# EAGLE design 549-teletouch-sensor (EAGLE 8.0.0)
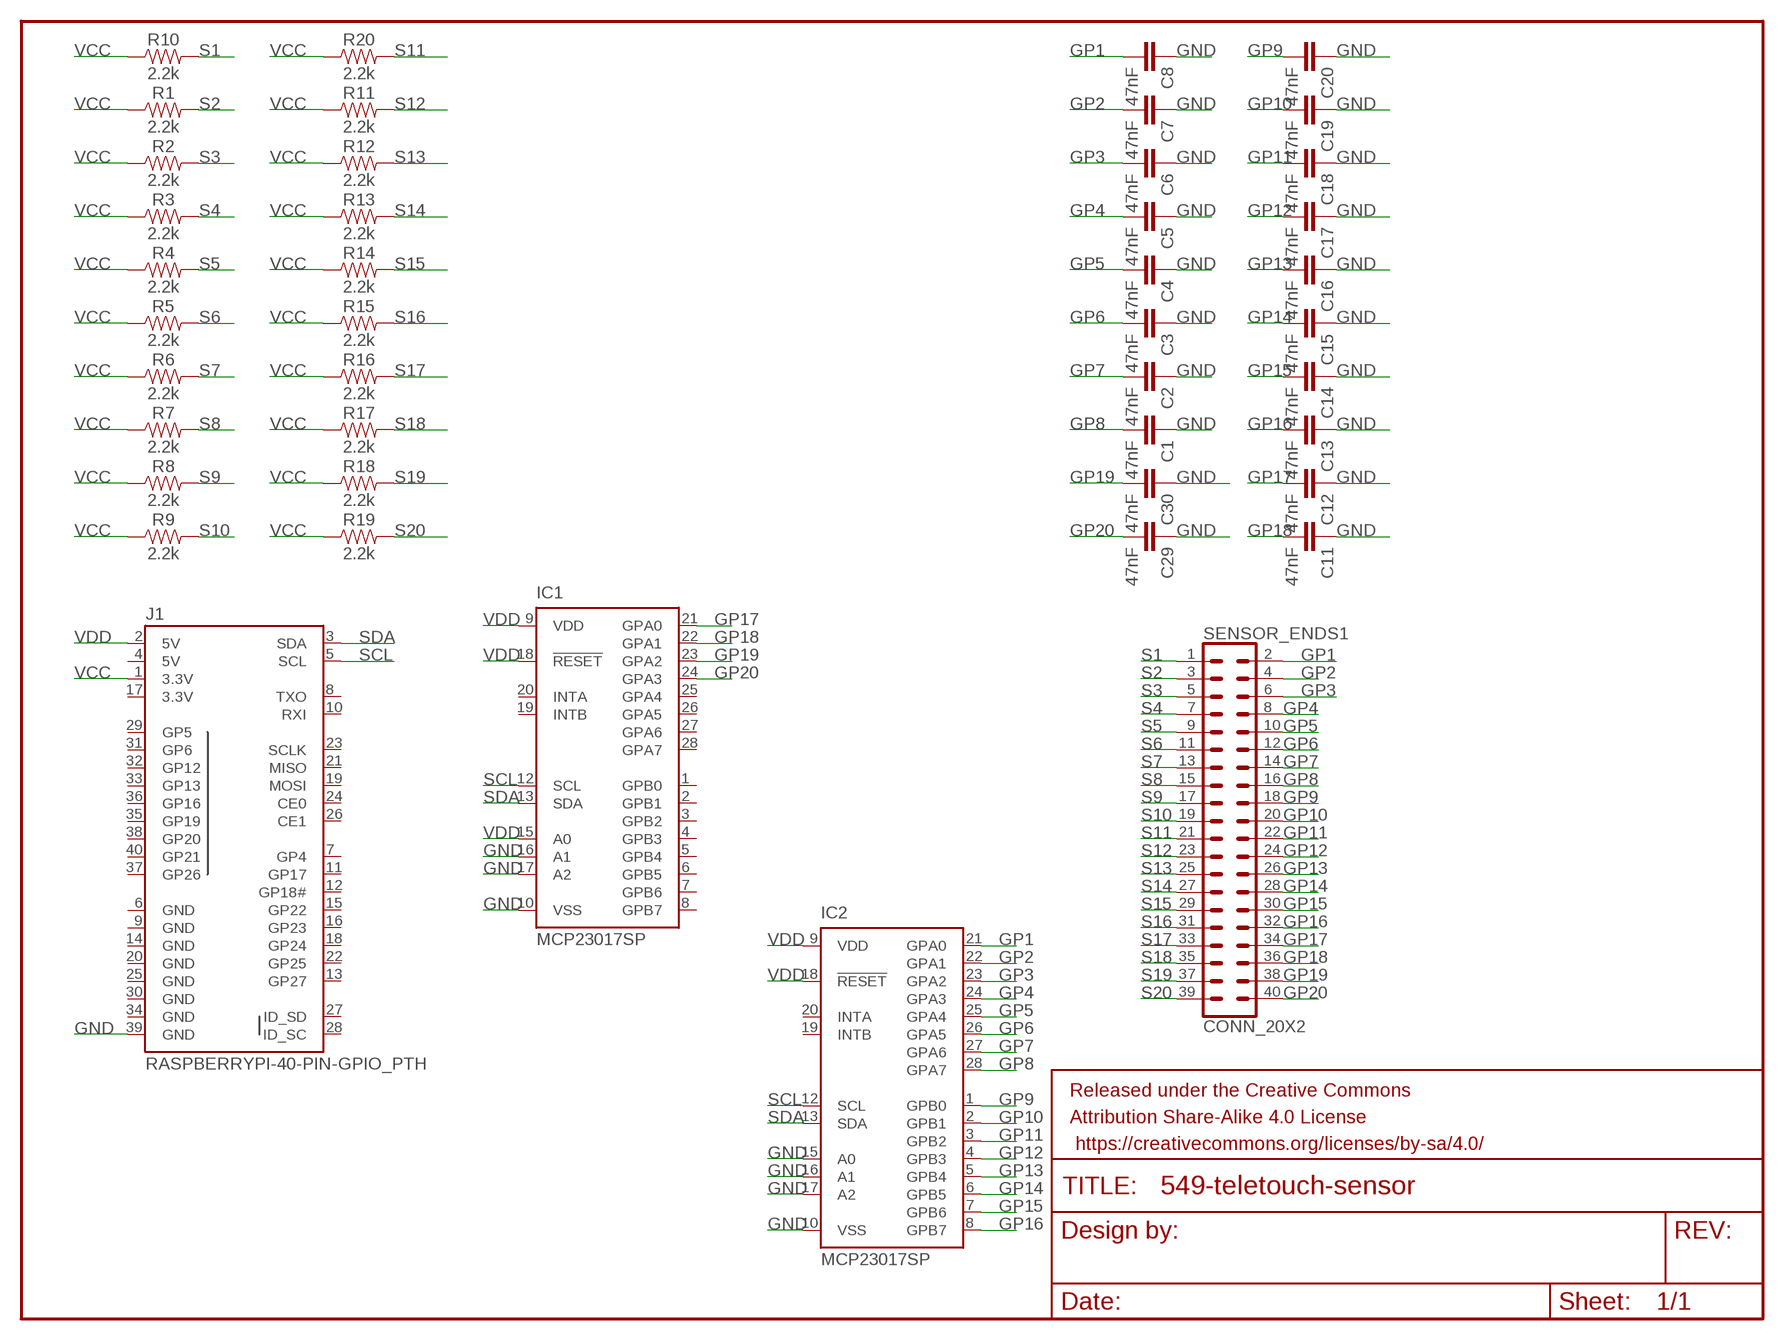
[diagram p0: schematic, sheet 1]

## Parts
C1  47nF  47NF-0603-25V-5%  [0603]
C2  47nF  47NF-0603-25V-5%  [0603]
C3  47nF  47NF-0603-25V-5%  [0603]
C4  47nF  47NF-0603-25V-5%  [0603]
C5  47nF  47NF-0603-25V-5%  [0603]
C6  47nF  47NF-0603-25V-5%  [0603]
C7  47nF  47NF-0603-25V-5%  [0603]
C8  47nF  47NF-0603-25V-5%  [0603]
C11  47nF  47NF-0603-25V-5%  [0603]
C12  47nF  47NF-0603-25V-5%  [0603]
C13  47nF  47NF-0603-25V-5%  [0603]
C14  47nF  47NF-0603-25V-5%  [0603]
C15  47nF  47NF-0603-25V-5%  [0603]
C16  47nF  47NF-0603-25V-5%  [0603]
C17  47nF  47NF-0603-25V-5%  [0603]
C18  47nF  47NF-0603-25V-5%  [0603]
C19  47nF  47NF-0603-25V-5%  [0603]
C20  47nF  47NF-0603-25V-5%  [0603]
C29  47nF  47NF-0603-25V-5%  [0603]
C30  47nF  47NF-0603-25V-5%  [0603]
FRAME1  FRAME-LETTER  [CREATIVE_COMMONS]
IC1  MCP23017SP  [DIL28-3]
IC2  MCP23017SP  [DIL28-3]
J1  RASPBERRYPI-40-PIN-GPIO_PTH  [2X20_SHROUDED]
R1  2.2k  2.2KOHM-0603-1/10W-1%  [0603]
R2  2.2k  2.2KOHM-0603-1/10W-1%  [0603]
R3  2.2k  2.2KOHM-0603-1/10W-1%  [0603]
R4  2.2k  2.2KOHM-0603-1/10W-1%  [0603]
R5  2.2k  2.2KOHM-0603-1/10W-1%  [0603]
R6  2.2k  2.2KOHM-0603-1/10W-1%  [0603]
R7  2.2k  2.2KOHM-0603-1/10W-1%  [0603]
R8  2.2k  2.2KOHM-0603-1/10W-1%  [0603]
R9  2.2k  2.2KOHM-0603-1/10W-1%  [0603]
R10  2.2k  2.2KOHM-0603-1/10W-1%  [0603]
R11  2.2k  2.2KOHM-0603-1/10W-1%  [0603]
R12  2.2k  2.2KOHM-0603-1/10W-1%  [0603]
R13  2.2k  2.2KOHM-0603-1/10W-1%  [0603]
R14  2.2k  2.2KOHM-0603-1/10W-1%  [0603]
R15  2.2k  2.2KOHM-0603-1/10W-1%  [0603]
R16  2.2k  2.2KOHM-0603-1/10W-1%  [0603]
R17  2.2k  2.2KOHM-0603-1/10W-1%  [0603]
R18  2.2k  2.2KOHM-0603-1/10W-1%  [0603]
R19  2.2k  2.2KOHM-0603-1/10W-1%  [0603]
R20  2.2k  2.2KOHM-0603-1/10W-1%  [0603]
SENSOR_ENDS1  CONN_20X2  [2X20]

## Nets
GND: C1.1 C2.1 C3.1 C4.1 C5.1 C6.1 C7.1 C8.1 C11.1 C12.1 C13.1 C14.1 C15.1 C16.1 C17.1 C18.1 C19.1 C20.1 C29.1 C30.1 IC1.10(VSS) IC1.16(A1) IC1.17(A2) IC2.10(VSS) IC2.15(A0) IC2.16(A1) IC2.17(A2) J1.39(GND)
GP1: C8.2 IC2.21(GPA0) SENSOR_ENDS1.2
GP2: C7.2 IC2.22(GPA1) SENSOR_ENDS1.4
GP3: C6.2 IC2.23(GPA2) SENSOR_ENDS1.6
GP4: C5.2 IC2.24(GPA3) SENSOR_ENDS1.8
GP5: C4.2 IC2.25(GPA4) SENSOR_ENDS1.10
GP6: C3.2 IC2.26(GPA5) SENSOR_ENDS1.12
GP7: C2.2 IC2.27(GPA6) SENSOR_ENDS1.14
GP8: C1.2 IC2.28(GPA7) SENSOR_ENDS1.16
GP9: C20.2 IC2.1(GPB0) SENSOR_ENDS1.18
GP10: C19.2 IC2.2(GPB1) SENSOR_ENDS1.20
GP11: C18.2 IC2.3(GPB2) SENSOR_ENDS1.22
GP12: C17.2 IC2.4(GPB3) SENSOR_ENDS1.24
GP13: C16.2 IC2.5(GPB4) SENSOR_ENDS1.26
GP14: C15.2 IC2.6(GPB5) SENSOR_ENDS1.28
GP15: C14.2 IC2.7(GPB6) SENSOR_ENDS1.30
GP16: C13.2 IC2.8(GPB7) SENSOR_ENDS1.32
GP17: C12.2 IC1.21(GPA0) SENSOR_ENDS1.34
GP18: C11.2 IC1.22(GPA1) SENSOR_ENDS1.36
GP19: C30.2 IC1.23(GPA2) SENSOR_ENDS1.38
GP20: C29.2 IC1.24(GPA3) SENSOR_ENDS1.40
S1: R10.2 SENSOR_ENDS1.1
S2: R1.2 SENSOR_ENDS1.3
S3: R2.2 SENSOR_ENDS1.5
S4: R3.2 SENSOR_ENDS1.7
S5: R4.2 SENSOR_ENDS1.9
S6: R5.2 SENSOR_ENDS1.11
S7: R6.2 SENSOR_ENDS1.13
S8: R7.2 SENSOR_ENDS1.15
S9: R8.2 SENSOR_ENDS1.17
S10: R9.2 SENSOR_ENDS1.19
S11: R20.2 SENSOR_ENDS1.21
S12: R11.2 SENSOR_ENDS1.23
S13: R12.2 SENSOR_ENDS1.25
S14: R13.2 SENSOR_ENDS1.27
S15: R14.2 SENSOR_ENDS1.29
S16: R15.2 SENSOR_ENDS1.31
S17: R16.2 SENSOR_ENDS1.33
S18: R17.2 SENSOR_ENDS1.35
S19: R18.2 SENSOR_ENDS1.37
S20: R19.2 SENSOR_ENDS1.39
SCL: IC1.12(SCL) IC2.12(SCL) J1.5(SCL)
SDA: IC1.13(SDA) IC2.13(SDA) J1.3(SDA)
VCC: J1.1(3.3V) R1.1 R2.1 R3.1 R4.1 R5.1 R6.1 R7.1 R8.1 R9.1 R10.1 R11.1 R12.1 R13.1 R14.1 R15.1 R16.1 R17.1 R18.1 R19.1 R20.1
VDD: IC1.9(VDD) IC1.15(A0) IC1.18(!RESET) IC2.9(VDD) IC2.18(!RESET) J1.2(5V)
Unconnected: IC1.1(GPB0) IC1.2(GPB1) IC1.3(GPB2) IC1.4(GPB3) IC1.5(GPB4) IC1.6(GPB5) IC1.7(GPB6) IC1.8(GPB7) IC1.19(INTB) IC1.20(INTA) IC1.25(GPA4) IC1.26(GPA5) IC1.27(GPA6) IC1.28(GPA7) IC2.19(INTB) IC2.20(INTA) J1.7(GP4) J1.8(TXO) J1.10(RXI) J1.11(GP17) J1.12(GP18#) J1.13(GP27) J1.15(GP22) J1.16(GP23) J1.18(GP24) J1.19(MOSI) J1.21(MISO) J1.22(GP25) J1.23(SCLK) J1.24(CE0) J1.26(CE1) J1.27(ID_SD) J1.28(ID_SC) J1.29(GP5) J1.31(GP6) J1.32(GP12) J1.33(GP13) J1.35(GP19) J1.36(GP16) J1.37(GP26) J1.38(GP20) J1.40(GP21)

## Power pins joined to a net without a drawn wire
3.3V: J1.17(3.3V)
5V: J1.4(5V)
GND: J1.6(GND) J1.9(GND) J1.14(GND) J1.20(GND) J1.25(GND) J1.30(GND) J1.34(GND)

## Library data of the parts
C1-C8 C11-C20 C29 C30 = SparkFun-Capacitors:47NF: 47nF ceramic capacitors A capacitor is a passive two-terminal electrical component used to store electrical energy temporarily in an electric field.; PROD_ID: CAP-08605
FRAME1 = SparkFun-Aesthetics:FRAME-LETTER: Schematic Frame - Letter Standard 8.5x11 US Letter frame
IC1 IC2 = adafruit:MCP23017: http://ww1.microchip.com/downloads/en/DeviceDoc/21952a.pdf Source: http://ww1.microchip.com/downloads/en/DeviceDoc/21952a.pdf
J1 = SparkFun-Connectors:RASPBERRYPI-40-PIN-GPIO: Raspberry Pi GPIO Header 2x20 pin connector, as found on B, B+, A+ models. Both shrouded PTH and SMT versions available. SparkFun Products: GPIO Shrouded Header <https://www.sparkfun.com/products/13054>- PTH SparkFun Pi Wedge (Preassembled) <https://www.sparkfun.com/products/13717>; PROD_ID: CONN-12263; SF_ID: PRT-13054
R1-R20 = SparkFun-Resistors:2.2KOHM: 2.2kΩ resistor A resistor is a passive two-terminal electrical component that implements electrical resistance as a circuit element. Resistors act to reduce current flow, and, at the same time, act to lower voltage levels within circuits. - Wikipedia; PROD_ID: RES-08272
SENSOR_ENDS1 = SparkFun-Connectors:CONN_20X2: Multi connection point. Often used as Generic Header-pin footprint for 0.1 inch spaced/style header connections On any of the 0.1 inch spaced packages, you can populate with these: Break Away Headers - Straight <https://www.sparkfun.com/products/116> (PRT-00116) Break Away Male Headers - Right Angle <https://www.sparkfun.com/products/553> (PRT-00553) Female Headers <https://www.sparkfun.com/products/115> (PRT-00115) Break Away Headers - Machine Pin <https://www.sparkfun.com/products/117> (PRT-00117) Break Away Female Headers - Swiss Machine Pin <https://www.sparkfun.com/products/743> (PRT-00743)

## Board
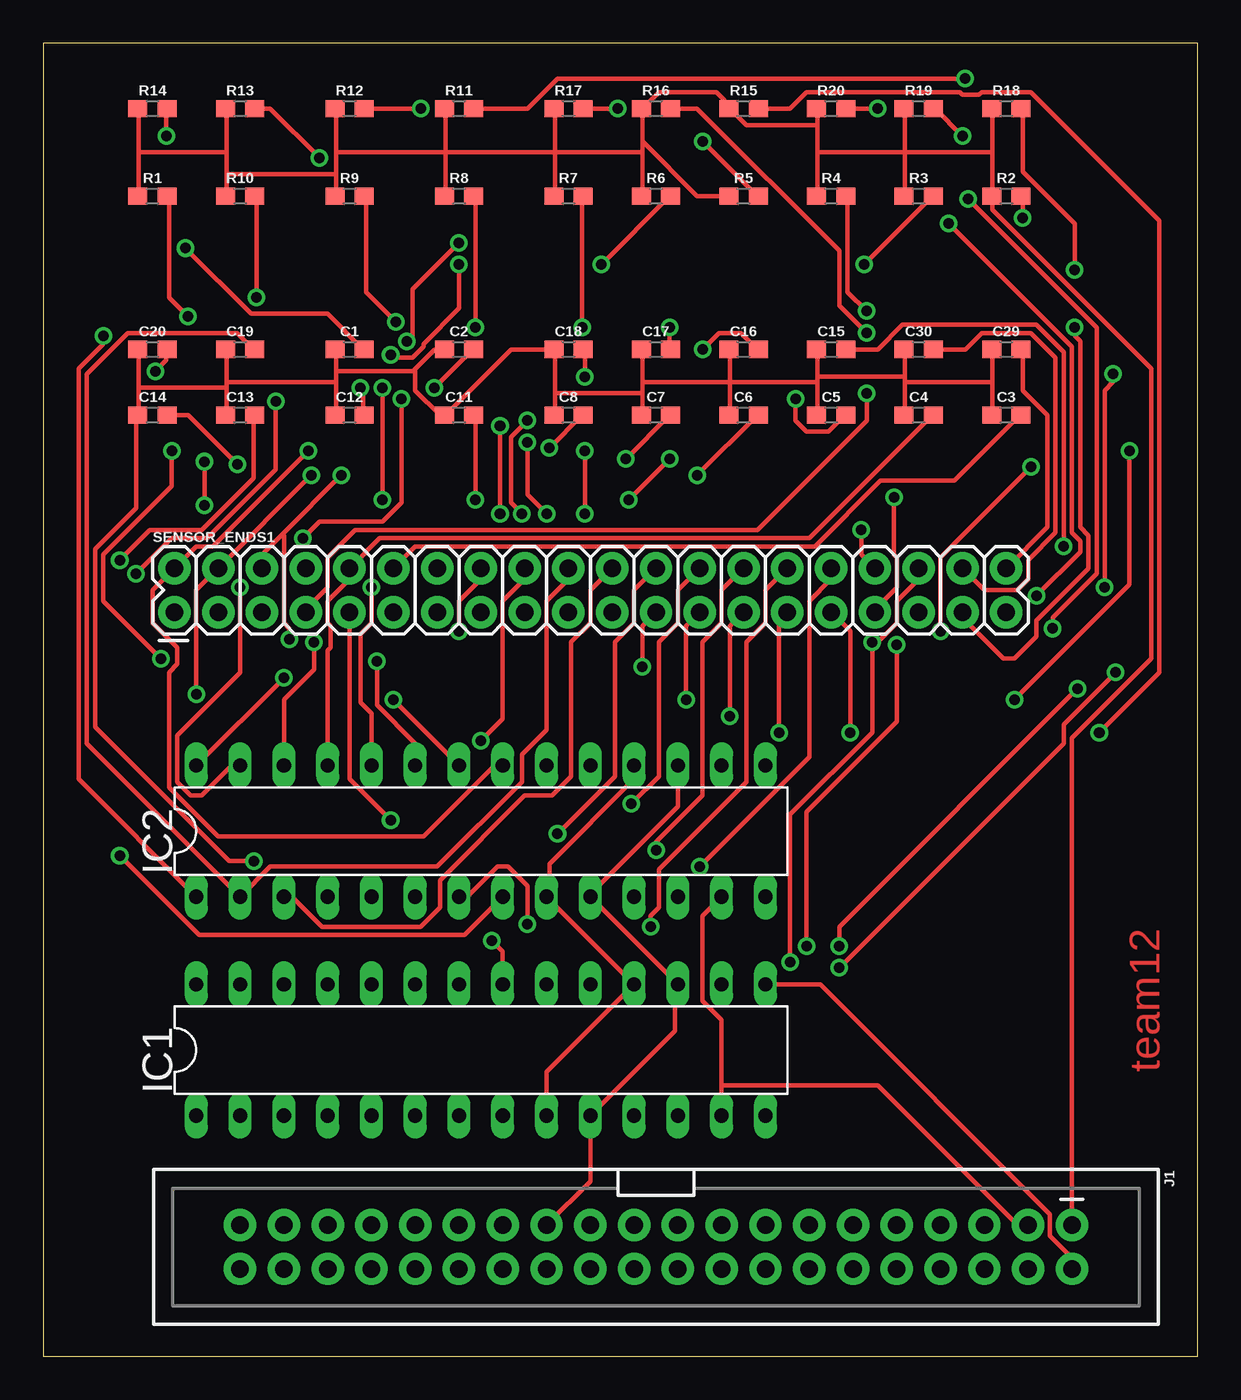
[diagram p1: board, top side]
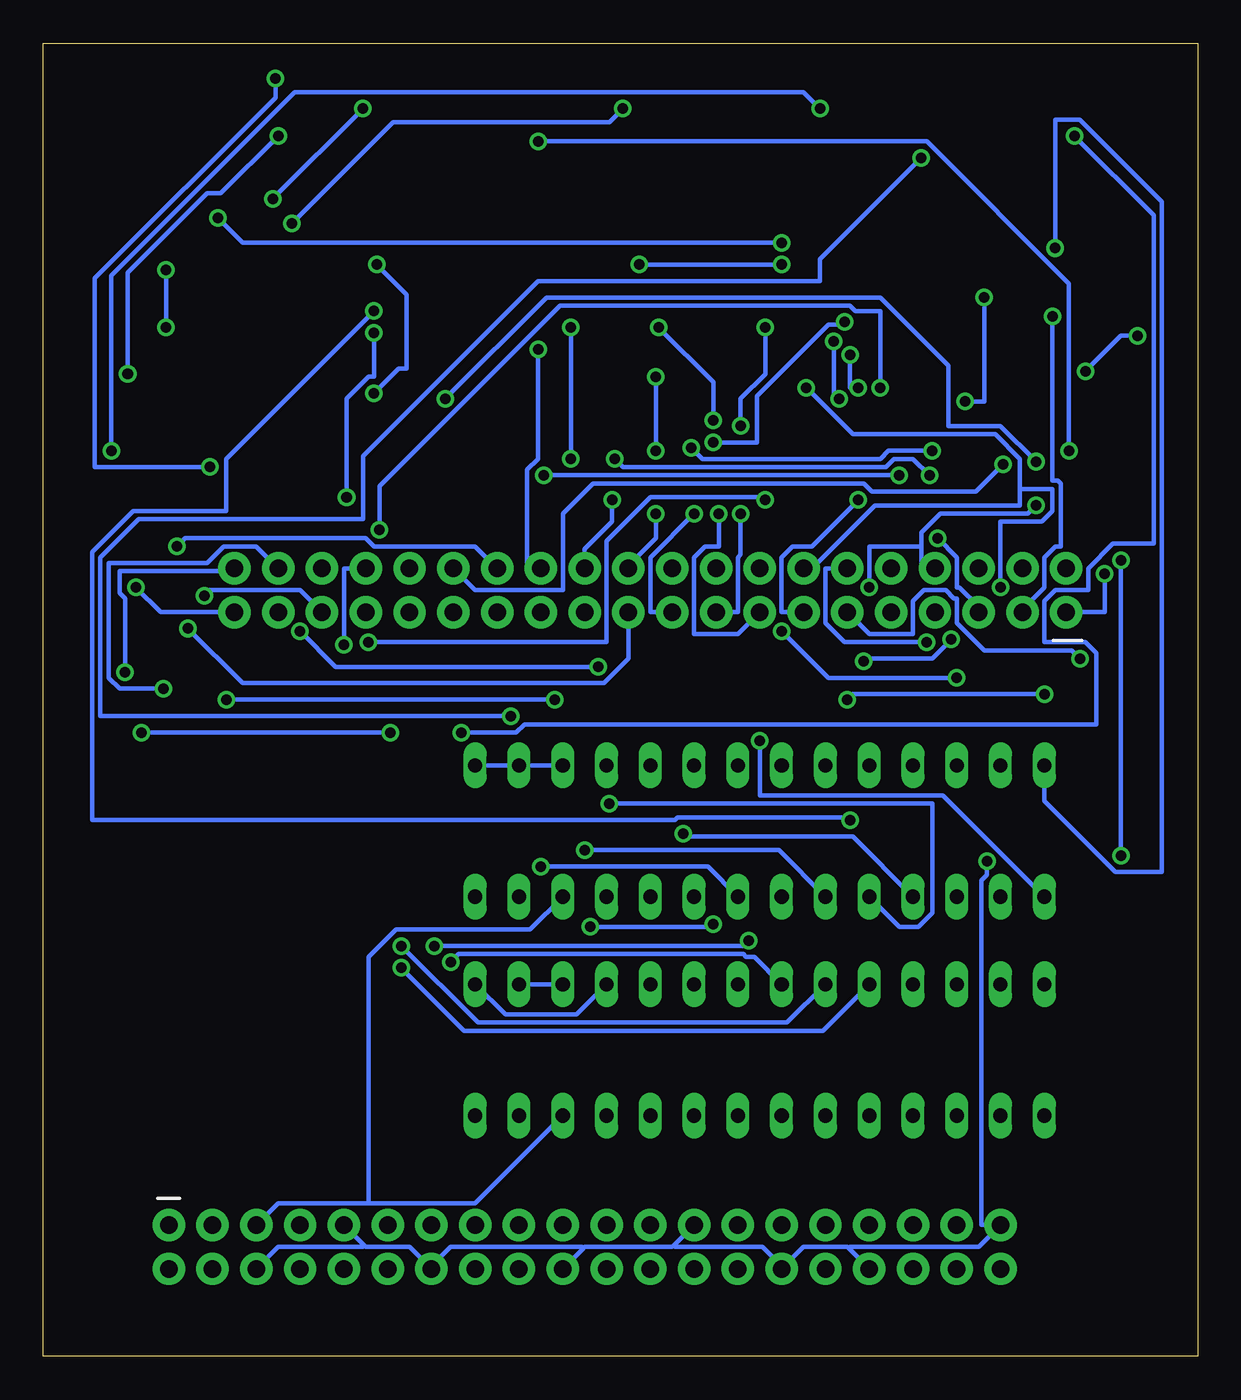
[diagram p2: board, bottom side, seen from below]

Size 66.98 x 76.19 mm. Coordinates in mm from the lower left corner, seen from the top.
Outline: 0,0 66.98,0 66.98,76.19 0,76.19 0,0
Copper layers (1*16): Top 0.035mm / dielectric 1.5mm / Bottom 0.035mm
Design rules "default": minimum track width 10mil, minimum drill 24mil, track to track 8mil, track to pad 8mil, pad to pad 8mil, via to via 8mil, smd to smd 8mil, copper to edge 40mil, drill to drill 8mil, minimum pad ring 10mil, minimum via ring 8mil, stop-mask expansion 4mil, vias tented up to drill 0mil, thermal gap 10mil

### Footprints (pad centres in the part's own frame; a part is rotated, then mirrored left to right if it is on the bottom)
0603 = smd 1.1 x 1: 1 -0.85,0; 2 0.85,0
DIL28-3 = drill 0.813 long: 1 -16.51,-3.81; 2 -13.97,-3.81; 3 -11.43,-3.81; 4 -8.89,-3.81; 5 -6.35,-3.81; 6 -3.81,-3.81; 7 -1.27,-3.81; 8 1.27,-3.81; 9 3.81,-3.81; 10 6.35,-3.81; 11 8.89,-3.81; 12 11.43,-3.81; 13 13.97,-3.81; 14 16.51,-3.81; 15 16.51,3.81; 16 13.97,3.81; 17 11.43,3.81; 18 8.89,3.81; 19 6.35,3.81; 20 3.81,3.81; 21 1.27,3.81; 22 -1.27,3.81; 23 -3.81,3.81; 24 -6.35,3.81; 25 -8.89,3.81; 26 -11.43,3.81; 27 -13.97,3.81; 28 -16.51,3.81
2X20_SHROUDED = drill 1.016 pad 1.88: 1 -1.27,24.13; 2 1.27,24.13; 3 -1.27,21.59; 4 1.27,21.59; 5 -1.27,19.05; 6 1.27,19.05; 7 -1.27,16.51; 8 1.27,16.51; 9 -1.27,13.97; 10 1.27,13.97; 11 -1.27,11.43; 12 1.27,11.43; 13 -1.27,8.89; 14 1.27,8.89; 15 -1.27,6.35; 16 1.27,6.35; 17 -1.27,3.81; 18 1.27,3.81; 19 -1.27,1.27; 20 1.27,1.27; 21 -1.27,-1.27; 22 1.27,-1.27; 23 -1.27,-3.81; 24 1.27,-3.81; 25 -1.27,-6.35; 26 1.27,-6.35; 27 -1.27,-8.89; 28 1.27,-8.89; 29 -1.27,-11.43; 30 1.27,-11.43; 31 -1.27,-13.97; 32 1.27,-13.97; 33 -1.27,-16.51; 34 1.27,-16.51; 35 -1.27,-19.05; 36 1.27,-19.05; 37 -1.27,-21.59; 38 1.27,-21.59; 39 -1.27,-24.13; 40 1.27,-24.13
2X20 = drill 1.016 pad 1.88: 1 0,0; 2 0,2.54; 3 2.54,0; 4 2.54,2.54; 5 5.08,0; 6 5.08,2.54; 7 7.62,0; 8 7.62,2.54; 9 10.16,0; 10 10.16,2.54; 11 12.7,0; 12 12.7,2.54; 13 15.24,0; 14 15.24,2.54; 15 17.78,0; 16 17.78,2.54; 17 20.32,0; 18 20.32,2.54; 19 22.86,0; 20 22.86,2.54; 21 25.4,0; 22 25.4,2.54; 23 27.94,0; 24 27.94,2.54; 25 30.48,0; 26 30.48,2.54; 27 33.02,0; 28 33.02,2.54; 29 35.56,0; 30 35.56,2.54; 31 38.1,0; 32 38.1,2.54; 33 40.64,0; 34 40.64,2.54; 35 43.18,0; 36 43.18,2.54; 37 45.72,0; 38 45.72,2.54; 39 48.26,0; 40 48.26,2.54

### Placement (x,y rotation side)
C1  17.78,58.42 0 top
C2  24.13,58.42 0 top
C3  55.88,54.61 0 top
C4  50.8,54.61 0 top
C5  45.72,54.61 0 top
C6  40.64,54.61 0 top
C7  35.56,54.61 0 top
C8  30.48,54.61 0 top
C11  24.13,54.61 0 top
C12  17.78,54.61 0 top
C13  11.43,54.61 0 top
C14  6.35,54.61 0 top
C15  45.72,58.42 0 top
C16  40.64,58.42 0 top
C17  35.56,58.42 0 top
C18  30.48,58.42 0 top
C19  11.43,58.42 0 top
C20  6.35,58.42 0 top
C29  55.88,58.42 0 top
C30  50.8,58.42 0 top
FRAME1  -101.6,76.2 0 top  (outside the outline)
IC1  25.4,17.78 0 top
IC2  25.4,30.48 0 top
J1  35.56,6.35 270 top
R1  6.35,67.31 0 top
R2  55.88,67.31 0 top
R3  50.8,67.31 0 top
R4  45.72,67.31 0 top
R5  40.64,67.31 0 top
R6  35.56,67.31 0 top
R7  30.48,67.31 0 top
R8  24.13,67.31 0 top
R9  17.78,67.31 0 top
R10  11.43,67.31 0 top
R11  24.13,72.39 0 top
R12  17.78,72.39 0 top
R13  11.43,72.39 0 top
R14  6.35,72.39 0 top
R15  40.64,72.39 0 top
R16  35.56,72.39 0 top
R17  30.48,72.39 0 top
R18  55.88,72.39 0 top
R19  50.8,72.39 0 top
R20  45.72,72.39 0 top
SENSOR_ENDS1  7.62,43.18 0 top

### Tracks (layer width: path | path; a pad name or v marks a point on that pad's centre or on a via)
GND  (via drill 0.61)
  Top 0.254: 5.56,56.2 5.56,58.42 C20.1 | 5.56,56.2 5.56,54.61 C14.1 5.4,54.61 5.4,49.21 3.02,46.83 3.02,36.51 10.79,28.73 v12.22,28.73 | 10.64,56.52 10.64,58.42 C19.1 | 10.64,56.52 10.64,56.2 | 10.64,56.2 10.64,54.61 C13.1 | 10.64,56.2 5.56,56.2 | 16.99,57.15 16.99,58.42 C1.1 | 16.99,57.15 16.99,56.52 | 16.99,56.52 16.99,54.61 C12.1 | C2.1 22.7,58.42 21.51,57.23 | 21.51,57.23 21.43,57.15 16.99,57.15 | 16.99,56.52 10.64,56.52 | 29.69,55.88 29.69,58.42 C18.1 27.15,58.42 23.34,54.61 C11.1 23.02,54.61 21.59,56.04 21.59,57.15 21.51,57.23 | 29.69,55.88 29.69,54.61 C8.1 | 50.01,56.83 50.01,58.42 C30.1 | 50.01,56.83 50.01,56.52 | 50.01,56.52 50.01,54.61 C4.1 | 55.09,56.52 55.09,58.42 C29.1 | 55.09,56.52 55.09,54.61 C3.1 | 55.09,56.52 50.01,56.52 | 44.93,56.83 44.93,58.42 C15.1 | 44.93,56.83 44.93,56.52 | 44.93,56.52 44.93,54.61 C5.1 | 34.77,56.52 34.77,58.42 C17.1 | 34.77,56.52 34.77,55.88 | 34.77,55.88 34.77,54.61 C7.1 | 39.85,56.52 39.85,58.42 C16.1 | 39.85,56.52 39.85,54.61 C6.1 | 39.85,56.52 34.77,56.52 | 39.85,56.52 44.93,56.52 | 44.93,56.83 50.01,56.83 | 34.77,55.88 29.69,55.88 | IC2.17 36.83,31.91 31.91,26.99 31.91,26.67 IC2.10 IC1.17 36.67,21.59 36.67,18.89 IC1.10 31.75,10.16 J1.25
  Bottom 0.254: IC2.17 IC2.16 IC2.15 | IC1.16 IC1.17 | 20.24,6.27 20.32,6.35 22.86,6.35 J1.30 24.13,5.24 25.24,6.35 30.32,6.35 30.4,6.43 | 20.24,6.27 J1.34 | 20.24,6.27 20.16,6.35 12.7,6.35 J1.39 12.54,7.62 12.54,27.62 12.22,27.94 v12.22,28.73 | J1.9 48.34,6.43 | 48.34,6.43 48.26,6.35 45.72,6.35 J1.14 44.45,5.24 43.34,6.35 35.72,6.35 35.64,6.27 | J1.6 53.34,6.35 48.42,6.35 48.34,6.43 | 35.64,6.27 35.56,6.35 30.48,6.35 30.4,6.43 | 35.64,6.27 J1.20 | J1.25 30.4,6.43
GP1  (via drill 0.61)
  Top 0.254: v29.37,52.7 31.27,54.61 C8.2 | v15.4,52.55 9.84,46.99 8.89,46.99 SENSOR_ENDS1.2 6.35,44.45 6.35,42.55 7.78,41.12 7.78,40.16 7.3,39.69 7.3,33.02 10.16,30.16 22.07,30.16 26.19,34.29 IC2.21
  Bottom 0.254: v29.37,52.7 28.73,52.07 18.41,52.07 17.94,52.55 v15.4,52.55
GP2  (via drill 0.61)
  Top 0.254: v33.81,52.07 36.35,54.61 C7.2 | v15.56,51.12 SENSOR_ENDS1.4 8.89,44.45 v8.89,38.42 | v20.32,38.1 IC2.22
  Bottom 0.254: v33.81,52.07 33.34,51.59 18.1,51.59 17.62,52.07 16.51,52.07 v15.56,51.12 | v20.32,38.1 20,38.42 v8.89,38.42
GP3  (via drill 0.61)
  Top 0.254: v37.94,51.12 41.43,54.61 C6.2 | 13.89,47.7 12.7,46.51 SENSOR_ENDS1.6 | 13.89,47.7 v17.3,51.12 | IC2.23 21.59,35.56 19.37,37.78 v19.37,40.32 | v14.29,41.59 14.29,42.23 13.97,42.55 13.97,47.62 13.89,47.7
  Bottom 0.254: v17.3,51.12 v37.94,51.12 | v19.37,40.32 19.21,40.48 15.4,40.48 v14.29,41.59
GP4  (via drill 0.61)
  Top 0.254: v43.66,55.56 43.66,54.29 44.29,53.66 45.56,53.66 46.51,54.61 C5.2 | v9.37,49.37 v9.37,51.91 | IC2.24 19.05,37.31 18.41,37.94 18.41,41.91 19.05,42.55 v19.05,44.61
  Bottom 0.254: v43.66,55.56 37.78,61.44 18.41,61.44 14.45,57.47 14.45,53.98 11.43,53.98 v9.37,51.91 | v9.37,49.37 9.84,48.9 14.92,48.9 16.03,47.78 16.03,46.99 | 16.03,46.99 16.03,45.72 SENSOR_ENDS1.8 | v19.05,44.61 19.05,46.99 16.03,46.99
GP5
  Top 0.254: C4.2 51.59,54.61 44.45,47.47 19.53,47.47 SENSOR_ENDS1.10 17.78,45.09 16.51,43.81 16.51,42.55 16.67,42.39 16.67,41.12 16.51,40.96 IC2.25
GP6  (via drill 0.61)
  Top 0.254: SENSOR_ENDS1.12 21.59,46.99 44.77,46.99 48.58,50.8 52.86,50.8 56.67,54.61 C3.2 | IC2.26 13.97,38.1 15.72,39.85 v15.72,41.43
  Bottom 0.254: v15.72,41.43 20.48,41.43 21.59,42.55 21.59,45.72 SENSOR_ENDS1.12
GP7  (via drill 0.61)
  Top 0.254: v22.7,56.2 24.92,58.42 C2.2 | IC2.27 10.95,34.29 9.21,32.54 8.57,32.54 7.78,33.34 7.78,36.04 11.43,39.69 v11.43,44.61
  Bottom 0.254: v22.7,56.2 20,53.5 11.75,53.5 10.32,52.07 10.32,50.32 | 10.32,50.32 10.32,49.37 18.73,49.37 22.38,45.72 SENSOR_ENDS1.14 | v11.43,44.61 11.43,48.42 9.05,48.42 8.41,49.05 8.41,50.32 10.32,50.32
GP8  (via drill 0.61)
  Top 0.254: v8.26,64.29 12.06,60.48 16.51,60.48 18.57,58.42 C1.2 | SENSOR_ENDS1.16 25.4,45.09 24.13,43.81 v24.13,42.07 | IC2.28 v13.97,39.37
  Bottom 0.254: v8.26,64.29 8.26,71.75 6.83,71.75 2.06,66.99 2.06,28.1 4.76,28.1 8.89,32.23 IC2.28 | v24.13,42.07 21.43,39.37 v13.97,39.37
GP9  (via drill 0.61)
  Top 0.254: v6.51,57.15 7.14,57.78 7.14,58.42 C20.2 | v3.49,59.21 3.49,58.74 2.06,57.31 2.06,33.5 IC2.1 | SENSOR_ENDS1.18 27.94,45.09 26.67,43.81 26.67,36.99 v25.4,35.72
  Bottom 0.254: v6.51,57.15 4.45,59.21 v3.49,59.21 | v25.4,35.72 25.4,32.54 14.76,32.54 IC2.1
GP10
  Top 0.254: C19.2 12.22,58.42 11.27,59.37 4.92,59.37 2.54,56.99 2.54,35.56 IC2.2 13.18,28.42 22.86,28.42 27.78,33.34 27.78,34.92 29.21,36.35 29.21,43.81 30.48,45.09 SENSOR_ENDS1.20
GP11  (via drill 0.61)
  Top 0.254: v31.43,56.83 31.43,58.42 C18.2 | v31.43,48.9 v31.43,52.55 | IC2.3 14.45,26.67 16.19,24.92 21.91,24.92 23.02,26.04 23.02,27.62 27.94,32.54 29.53,32.54 30.64,33.66 30.64,41.43 31.75,42.55 31.75,44.45 SENSOR_ENDS1.22
  Bottom 0.254: v31.43,52.55 v31.43,56.83 | v31.43,48.9 31.43,47.47 33.02,45.88 SENSOR_ENDS1.22
GP12  (via drill 0.61)
  Top 0.254: v36.35,59.69 36.35,58.42 C17.2 | v33.97,49.69 v36.35,52.07 | v29.84,30.32 33.18,33.66 33.18,41.43 34.29,42.55 34.29,44.45 SENSOR_ENDS1.24
  Bottom 0.254: v36.35,52.07 v36.35,59.69 | v33.97,49.69 33.97,48.42 35.56,46.83 SENSOR_ENDS1.24 | IC2.4 20,30.16 29.69,30.16 v29.84,30.32
GP13  (via drill 0.61)
  Top 0.254: v38.26,58.42 39.21,59.37 40.48,59.37 41.43,58.42 C16.2 | v34.13,32.07 35.72,33.66 35.72,41.43 36.83,42.55 36.83,44.45 SENSOR_ENDS1.26
  Bottom 0.254: v38.26,58.42 38.26,52.07 38.89,51.44 38.89,45.72 SENSOR_ENDS1.26 | IC2.5 17.3,24.92 16.19,24.92 15.4,25.72 15.4,32.07 v34.13,32.07
GP14  (via drill 0.61)
  Top 0.254: C15.2 48.42,58.42 49.85,59.85 57.63,59.85 59.21,58.26 v59.21,46.99 | v35.56,29.37 35.56,29.84 38.26,32.54 38.26,41.43 39.37,42.55 39.37,44.45 SENSOR_ENDS1.28
  Bottom 0.254: v59.21,46.99 58.74,47.47 48.26,47.47 47.78,46.99 41.91,46.99 SENSOR_ENDS1.28 | IC2.6 24.29,29.37 v35.56,29.37
GP15  (via drill 0.61)
  Top 0.254: C14.2 8.41,54.61 v11.27,51.75 | IC2.7 24.61,26.67 26.35,28.42 26.99,28.42 28.1,27.3 v28.1,25.08 | v35.24,24.92 35.24,25.56 35.72,26.04 35.72,28.26 40.8,33.34 40.8,41.43 41.91,42.55 41.91,44.45 SENSOR_ENDS1.30
  Bottom 0.254: v11.27,51.75 12.86,50.16 18.89,50.16 19.37,50.64 35.08,50.64 36.83,48.9 36.83,44.45 41.91,44.45 SENSOR_ENDS1.30 | v28.1,25.08 28.26,24.92 v35.24,24.92
GP16  (via drill 0.61)
  Top 0.254: v4.45,46.2 6.19,47.94 9.21,47.94 12.22,50.96 12.22,54.61 C13.2 | v4.45,29.05 9.05,24.45 24.45,24.45 IC2.8 | SENSOR_ENDS1.32 45.72,45.09 44.45,43.81 44.45,34.77 v38.1,28.42
  Bottom 0.254: v4.45,29.05 v4.45,46.2 | v38.1,28.42 28.42,28.42 IC2.8
GP17  (via drill 0.61)
  Top 0.254: v18.41,56.2 18.57,56.04 18.57,54.61 C12.2 | v47.47,47.94 47.47,46.51 SENSOR_ENDS1.34 | IC1.21 26.67,23.5 v26.04,24.13 | v44.29,23.81 44.29,31.59 49.53,36.83 v49.53,41.27
  Bottom 0.254: v18.41,56.2 18.41,60.64 19.84,60.64 20.16,60.96 36.99,60.96 47.47,50.48 v47.47,47.94 | v26.04,24.13 26.35,23.81 v44.29,23.81 | v49.53,41.27 49.53,45.72 SENSOR_ENDS1.34
GP18  (via drill 0.61)
  Top 0.254: v25.08,49.69 25.08,54.61 C11.2 | SENSOR_ENDS1.36 50.8,45.09 49.53,43.81 49.53,42.55 48.42,41.43 v48.1,41.43 48.1,36.2 43.34,31.43 v43.34,22.86
  Bottom 0.254: v25.08,49.69 25.24,49.85 31.75,49.85 34.29,47.31 34.29,41.43 v48.1,41.43 | IC1.22 25.72,23.18 26.19,23.18 26.35,23.34 42.86,23.34 v43.34,22.86
GP19  (via drill 0.61)
  Top 0.254: C30.2 53.5,58.42 54.45,59.37 57.31,59.37 58.74,57.94 58.74,47.78 57.15,46.2 57.15,45.09 56.52,44.45 54.61,44.45 SENSOR_ENDS1.38 | v46.2,23.81 46.2,24.92 v60.01,38.73
  Bottom 0.254: IC1.23 23.81,19.37 41.75,19.37 v46.2,23.81 | v60.01,38.73 62.55,38.73 63.18,39.37 63.18,46.04 57.47,46.04 56.52,46.99 54.61,46.99 SENSOR_ENDS1.38
GP20  (via drill 0.61)
  Top 0.254: SENSOR_ENDS1.40 58.26,48.1 58.26,54.61 56.83,56.04 56.83,58.42 C29.2 | v46.2,22.54 59.21,35.56 59.21,36.67 v62.23,39.69
  Bottom 0.254: IC1.24 21.75,18.89 42.55,18.89 v46.2,22.54 | v62.23,39.69 62.23,43.97 62.55,44.29 62.55,45.56 56.04,45.56 SENSOR_ENDS1.40
S1  (via drill 0.61)
  Top 0.254: v12.38,61.44 12.38,67.31 R10.2 | v13.49,55.4 13.49,51.44 9.53,47.47 7.46,47.47 v5.4,45.4
  Bottom 0.254: v12.38,61.44 12.38,55.4 v13.49,55.4 | v5.4,45.4 5.4,43.18 SENSOR_ENDS1.1
S2  (via drill 0.61)
  Top 0.254: v8.41,60.33 7.3,61.44 7.3,67.31 R1.2
  Bottom 0.254: v8.41,60.33 8.41,50.8 8.1,50.8 7.94,50.64 7.94,46.99 8.26,46.99 8.89,46.35 8.89,44.61 10.16,43.34 SENSOR_ENDS1.3
S3  (via drill 0.61)
  Top 0.254: v56.83,66.04 56.83,67.31 R2.2 | v24.13,64.61 21.43,61.91 21.43,59.21 v21.11,58.9 | v20.8,55.56 20.8,49.53 19.68,48.42 16.03,48.42 v15.08,47.47
  Bottom 0.254: v56.83,66.04 55.4,64.61 v24.13,64.61 | v21.11,58.9 21.11,55.56 v20.8,55.56 | v15.08,47.47 13.97,46.35 13.97,44.61 13.81,44.61 12.7,43.5 SENSOR_ENDS1.5
S4  (via drill 0.61)
  Top 0.254: v47.62,63.34 51.59,67.31 R3.2 | v47.78,55.88 47.78,54.29 41.43,47.94 18.1,47.94 16.51,46.35 16.51,44.61 15.24,43.34 SENSOR_ENDS1.7
  Bottom 0.254: v47.62,63.34 45.88,61.59 45.88,57.31 46.35,57.31 v47.78,55.88
S5  (via drill 0.61)
  Top 0.254: v47.78,60.64 46.67,61.75 46.67,67.31 R4.2 | v20.16,31.11 17.78,33.5 SENSOR_ENDS1.9
  Bottom 0.254: v47.78,60.64 56.36,52.07 56.36,49.05 61.75,49.05 64.14,46.67 64.14,31.11 30.32,31.11 30.16,31.27 20.32,31.27 v20.16,31.11
S6  (via drill 0.61)
  Top 0.254: v38.26,70.48 41.43,67.31 R5.2 | v7.46,52.55 7.46,50.48 3.49,46.51 3.49,43.81 v6.83,40.48
  Bottom 0.254: v38.26,70.48 15.72,70.48 7.46,62.23 v7.46,52.55 | v6.83,40.48 7.3,40.96 12.38,40.96 13.97,42.55 13.97,43.97 14.13,43.97 14.61,44.45 15.88,44.45 16.51,43.81 16.51,41.91 19.05,41.91 SENSOR_ENDS1.11
S7  (via drill 0.61)
  Top 0.254: v32.38,63.34 36.35,67.31 R6.2 | v24.13,63.34 24.13,60.8 22.07,58.74 22.07,58.58 21.43,57.94 20.32,57.94 v20.16,58.1 | v19.68,49.69 v19.68,56.2
  Bottom 0.254: v24.13,63.34 v32.38,63.34 | v20.16,58.1 20.16,56.2 v19.68,56.2 | v19.68,49.69 22.38,46.99 23.5,46.99 24.13,46.35 24.13,43.18 SENSOR_ENDS1.13
S8  (via drill 0.61)
  Top 0.254: v31.27,59.69 31.27,67.31 R7.2 | v28.1,54.29 27.15,53.34 27.15,49.53 v27.78,48.9
  Bottom 0.254: v31.27,59.69 28.1,56.52 v28.1,54.29 | v27.78,48.9 27.78,46.99 28.57,46.99 29.21,46.35 29.21,41.91 26.67,41.91 SENSOR_ENDS1.15
S9  (via drill 0.61)
  Top 0.254: v25.08,59.69 25.08,67.31 R8.2 | v26.51,48.9 v26.51,53.98
  Bottom 0.254: v25.08,59.69 25.08,56.99 26.51,55.56 v26.51,53.98 | v26.51,48.9 26.51,46.51 26.67,46.35 26.67,43.18 SENSOR_ENDS1.17
S10  (via drill 0.61)
  Top 0.254: v20.48,60.01 18.73,61.75 18.73,67.31 R9.2 | v28.1,53.02 28.1,50.01 v29.21,48.9
  Bottom 0.254: v20.48,60.01 20.64,59.85 21.43,59.85 25.56,55.72 25.56,53.02 v28.1,53.02 | v29.21,48.9 31.75,46.35 31.75,43.18 SENSOR_ENDS1.19
S11  (via drill 0.61)
  Top 0.254: v48.42,72.39 R20.2 | v53.66,67.15 61.12,59.69 61.12,45.4 58.58,42.86 v58.58,42.23
  Bottom 0.254: v53.66,67.15 v48.42,72.39 | v58.58,42.23 55.4,39.05 34.45,39.05 33.02,40.48 SENSOR_ENDS1.21
S12  (via drill 0.61)
  Top 0.254: R11.2 28.1,72.39 29.84,74.14 v53.5,74.14 | v57.31,51.59 52.07,46.35 v52.07,42.07 | v34.77,40.01 34.77,42.39 SENSOR_ENDS1.23
  Bottom 0.254: v53.5,74.14 53.5,73.03 63.98,62.55 63.98,51.59 v57.31,51.59 | v52.07,42.07 50.01,40.01 v34.77,40.01
S13  (via drill 0.61)
  Top 0.254: v21.91,72.39 R12.2 | v63.02,52.55 63.02,44.77 v56.36,38.1 | v37.31,38.1 37.31,42.39 SENSOR_ENDS1.25
  Bottom 0.254: v21.91,72.39 22.86,73.34 52.39,73.34 63.02,62.71 v63.02,52.55 | v37.31,38.1 v56.36,38.1
S14  (via drill 0.61)
  Top 0.254: R13.2 13.18,72.39 v16.03,69.53 | v39.85,37.15 39.85,42.39 SENSOR_ENDS1.27
  Bottom 0.254: v16.03,69.53 21.91,63.66 21.91,62.39 38.26,62.39 48.42,52.23 48.42,48.58 61.44,48.58 63.66,46.35 63.66,37.15 v39.85,37.15
S15  (via drill 0.61)
  Top 0.254: v7.14,70.8 7.14,72.39 R14.2 | v42.7,36.2 42.7,42.7 SENSOR_ENDS1.29
  Bottom 0.254: v7.14,70.8 2.54,66.2 2.54,47.15 4.92,47.15 6.35,45.72 6.35,44.45 8.26,44.45 8.89,43.81 8.89,41.43 6.51,41.43 5.87,40.8 5.87,36.67 39.05,36.67 39.53,36.2 v42.7,36.2
S16  (via drill 0.61)
  Top 0.254: R15.2 43.34,72.39 44.29,73.34 53.18,73.34 53.34,73.18 54.29,73.18 54.45,73.34 57.31,73.34 64.77,65.88 64.77,39.69 v61.28,36.2 | v46.83,36.2 46.83,42.07 SENSOR_ENDS1.31
  Bottom 0.254: v46.83,36.2 v61.28,36.2
S17  (via drill 0.61)
  Top 0.254: R16.2 37.94,72.39 46.2,64.14 46.2,60.96 v47.78,59.37 | v49.37,49.85 49.37,46.51 49.53,46.35 49.53,44.61 48.26,43.34 SENSOR_ENDS1.33
  Bottom 0.254: v47.78,59.37 47.78,56.83 48.1,56.83 49.37,55.56 v49.37,49.85
S18  (via drill 0.61)
  Top 0.254: v33.34,72.39 R17.2 | v52.55,65.72 59.69,58.58 59.69,47.78 60.17,47.31 60.17,46.67 v57.63,44.13
  Bottom 0.254: v33.34,72.39 34.13,71.6 46.67,71.6 v52.55,65.72 | v57.63,44.13 57.31,44.45 52.07,44.45 SENSOR_ENDS1.35
S19  (via drill 0.61)
  Top 0.254: v59.85,63.02 59.85,65.72 56.83,68.74 56.83,72.39 R18.2 | v59.85,59.69 59.85,59.21 60.17,58.9 60.17,48.1 60.64,47.62 60.64,45.72 57.63,42.7 57.63,41.75 56.36,40.48 55.72,40.48 53.34,42.86 SENSOR_ENDS1.37
  Bottom 0.254: v59.85,59.69 v59.85,63.02
S20  (via drill 0.61)
  Top 0.254: v53.34,70.8 51.75,72.39 R19.2 | v62.07,56.99 62.07,56.52 61.59,56.04 v61.59,44.61
  Bottom 0.254: v53.34,70.8 56.67,67.47 57.47,67.47 62.07,62.87 v62.07,56.99 | v61.59,44.61 60.17,43.18 SENSOR_ENDS1.39
SCL
  Bottom 0.254: IC1.12 41.91,8.89 48.1,8.89 | 48.1,8.89 53.34,8.89 J1.5 | IC2.12 38.73,24.77 46.51,24.77 48.1,23.18 48.1,8.89
SDA
  Top 0.254: 39.37,15.72 39.37,19.53 38.26,20.64 38.26,25.56 IC2.13 | 39.37,15.72 IC1.13 | J1.3 56.52,7.62 48.42,15.72 39.37,15.72
VCC
  Top 0.254: 29.69,69.85 29.69,72.39 R17.1 | 29.69,69.85 29.69,67.31 R7.1 | 34.77,72.39 34.77,70.48 | 34.77,70.48 34.77,69.85 | 34.77,69.85 34.77,67.31 R6.1 | R5.1 37.94,67.31 34.77,70.48 | 34.77,69.85 29.69,69.85 | 5.56,69.85 5.56,72.39 R14.1 | 5.56,69.85 5.56,67.31 R1.1 | 10.64,69.85 10.64,72.39 R13.1 | 10.64,69.85 10.64,68.58 | 10.64,68.58 10.64,67.31 R10.1 | 10.64,69.85 5.56,69.85 | 16.99,69.85 16.99,72.39 R12.1 | 16.99,69.85 16.99,68.58 | 16.99,68.58 16.99,67.31 R9.1 | 23.34,69.85 23.34,72.39 R11.1 | 23.34,69.85 23.34,67.31 R8.1 | 23.34,69.85 16.99,69.85 | 16.99,68.58 10.64,68.58 | 23.34,69.85 29.69,69.85 | 55.09,69.85 55.09,72.39 R18.1 | 55.09,69.85 55.09,67.31 | 50.01,69.85 50.01,72.39 R19.1 | 50.01,69.85 50.01,67.31 R3.1 | 44.93,71.44 44.93,72.39 R20.1 | 44.93,71.44 44.93,69.85 | 44.93,69.85 44.93,67.31 R4.1 | 44.93,71.44 40.8,71.44 39.85,72.39 R15.1 40.01,72.39 39.05,73.34 35.72,73.34 34.77,72.39 | 44.93,69.85 50.01,69.85 | 50.01,69.85 55.09,69.85 | J1.1 59.69,35.88 64.29,40.48 64.29,57.31 55.09,66.52 55.09,67.31 | 55.09,67.31 R2.1 | 34.77,72.39 R16.1
VDD
  Top 0.254: IC1.9 29.21,16.51 IC1.18 IC2.9 29.37,26.67 29.37,28.57 34.29,33.5 IC2.18 | J1.2 59.69,5.71 58.42,6.99 58.42,8.26 45.09,21.59 IC1.15
  Bottom 0.254: IC1.15 40.16,19.84 36.04,19.84 IC1.18

### Text on the board
Top: team12